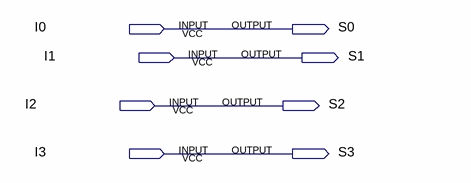
[diagram p0: schematic sheet]
// Quartus schematic Conv4Barre.bdf as structural Verilog: 0 symbols, 8 pins
module Conv4Barre (
  input  I0,
  input  I1,
  input  I2,
  input  I3,
  output S0,
  output S1,
  output S2,
  output S3
);


  assign S0 = I0;
  assign S1 = I1;
  assign S2 = I2;
  assign S3 = I3;
endmodule
